# Altium schematic sheet ESP32.SchDoc
size A4
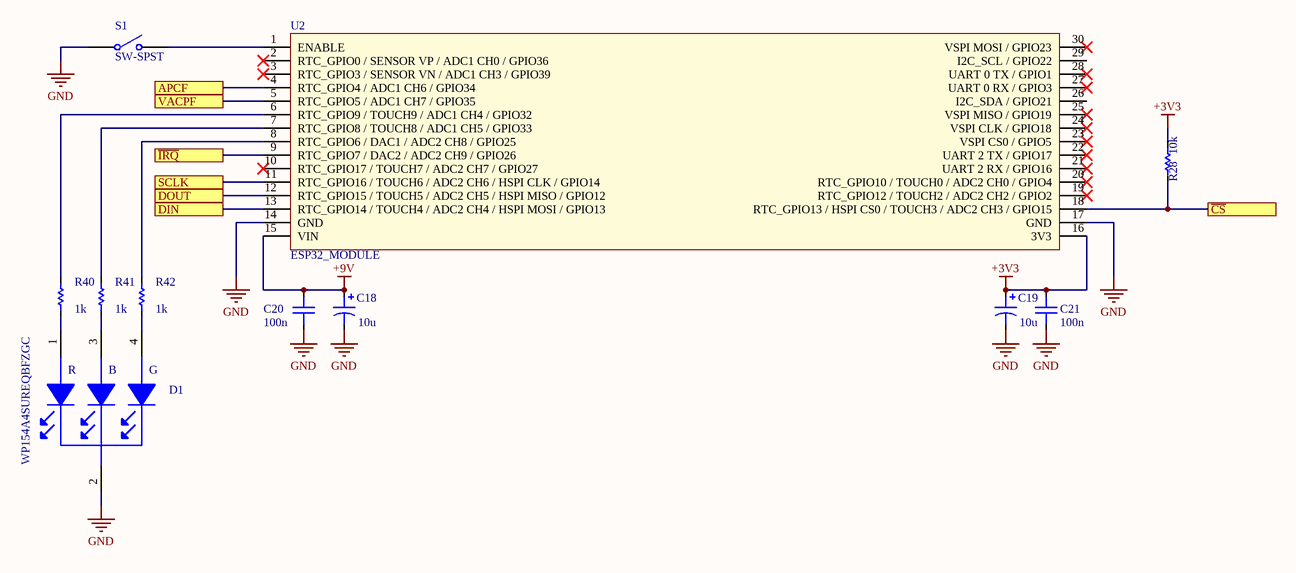
[diagram p0: ESP32.SchDoc]

## Parts
C18  value 10u  [CAP1210 - TANTALUM]  (hidden comment: Capacitor)
C19  value 10u  [CAP1210 - TANTALUM]  (hidden comment: Capacitor)
C20  value 100n  [CAP0603]  (hidden comment: Capacitor)
C21  value 100n  [CAP0603]  (hidden comment: Capacitor)
D1  WP154A4SUREQBFZGC  [HDR1X4]
R28  value 10k  [RES0603]  (hidden comment: Resistor)
R40  value 1k  [RES0603]  (hidden comment: Resistor)
R41  value 1k  [RES0603]  (hidden comment: Resistor)
R42  value 1k  [RES0603]  (hidden comment: Resistor)
S1  SW-SPST  [HDR1X2]
U2  ESP32_MODULE  [ESP32 DEVKIT V1 DOIT]

## Ports
APCF, DIN, DOUT, SCLK, VACPF, ~{CS}, ~{IRQ}

## Nets
+3V3: C19.1 C21.2 R28.1 U2.16(3V3)
+9V: C18.1 C20.2 U2.15(VIN)
GND: C18.2 C19.2 C20.1 C21.1 D1.2(K) S1.1(COMMON) U2.14(GND) U2.17(GND)
APCF: U2.4(RTC_GPIO4_/_ADC1_CH6_/_GPIO34) ; port APCF
~{CS}: R28.2 U2.18(RTC_GPIO13_/_HSPI_CS0_/_TOUCH3_/_ADC2_CH3_/_GPIO15) ; port ~{CS}
DIN: U2.13(RTC_GPIO14_/_TOUCH4_/_ADC2_CH4_/_HSPI_MOSI_/_GPIO13) ; port DIN
DOUT: U2.12(RTC_GPIO15_/_TOUCH5_/_ADC2_CH5_/_HSPI_MISO_/_GPIO12) ; port DOUT
~{IRQ}: U2.9(RTC_GPIO7_/_DAC2_/_ADC2_CH9_/_GPIO26) ; port ~{IRQ}
SCLK: U2.11(RTC_GPIO16_/_TOUCH6_/_ADC2_CH6_/_HSPI_CLK_/_GPIO14) ; port SCLK
VACPF: U2.5(RTC_GPIO5_/_ADC1_CH7_/_GPIO35) ; port VACPF
NetD1_1: D1.1(A1) R40.2
NetD1_3: D1.3(A2) R41.2
NetD1_4: D1.4(A3) R42.2
NetR40_1: R40.1 U2.6(RTC_GPIO9_/_TOUCH9_/_ADC1_CH4_/_GPIO32)
NetR41_1: R41.1 U2.7(RTC_GPIO8_/_TOUCH8_/_ADC1_CH5_/_GPIO33)
NetR42_1: R42.1 U2.8(RTC_GPIO6_/_DAC1_/_ADC2_CH8_/_GPIO25)
NetS1_2: S1.2(NO) U2.1(ENABLE)

Not connected (* = marked no-connect by the designer): U2 2(RTC_GPIO0_/_SENSOR_VP_/_ADC1_CH0_/_GPIO36)* 3(RTC_GPIO3_/_SENSOR_VN_/_ADC1_CH3_/_GPIO39)* 10(RTC_GPIO17_/_TOUCH7_/_ADC2_CH7_/_GPIO27)* 19(RTC_GPIO12_/_TOUCH2_/_ADC2_CH2_/_GPIO2)* 20(RTC_GPIO10_/_TOUCH0_/_ADC2_CH0_/_GPIO4)* 21(UART_2_RX_/_GPIO16)* 22(UART_2_TX_/_GPIO17)* 23(VSPI_CS0_/_GPIO5)* 24(VSPI_CLK_/_GPIO18)* 25(VSPI_MISO_/_GPIO19)* 26(I2C_SDA_/_GPIO21) 27(UART_0_RX_/_GPIO3)* 28(UART_0_TX_/_GPIO1)* 29(I2C_SCL_/_GPIO22) 30(VSPI_MOSI_/_GPIO23)*

## Notes on the sheet
- (in symbol LED RGB K) R; B; G

## Library data of the parts
C18 C19 = Capacitor Polarizado
D1 = LED RGB K: Manufacturer: Kingbright; Component Footprint: LED_RGB_5mm; CompType: LED; Tem na PHB: Não; Part Number: WP154A4SUREQBFZGC; Value: WP154A4SUREQBFZGC
S1 = SW-SPST: Single-Pole, Single-Throw Switch; Published: 24-Mar-1999; LatestRevisionDate: 17-Jul-2002; LatestRevisionNote: Re-released for DXP Platform.; PackageReference: SPST-2; Publisher: Altium Limited; PackageDescription: Switch; 2 Leads
U2 = ESP32_MODULE: Manufacturer: -; PCB Info: -; Value: -; Part Number: ESP32_MODULE